# Altium schematic sheet Sheet1.SchDoc
size A
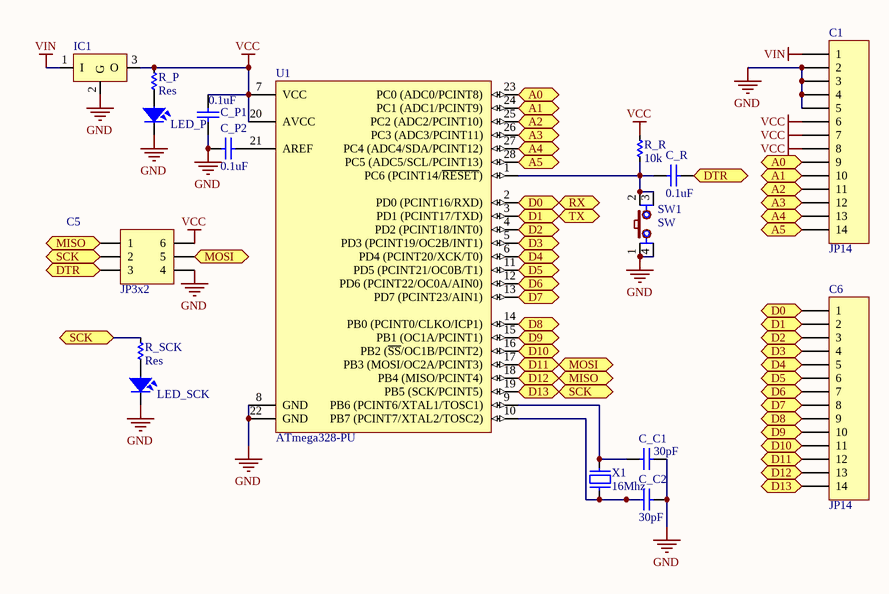
[diagram p0: Sheet1.SchDoc]

## Parts
C1  JP14  [JP14-D1T]
C5  JP3x2  [JP3-C2T]
C6  JP14  [JP14-D1T]
C_C1  value 30pF  [Cap Non-Pol 3mm]  (hidden comment: Cap Non-pol)
C_C2  value 30pF  [Cap Non-Pol 3mm]  (hidden comment: Cap Non-pol)
C_P1  value 0.1uF  [Cap Non-Pol 3mm]  (hidden comment: Cap Non-pol)
C_P2  value 0.1uF  [Cap Non-Pol 3mm]  (hidden comment: Cap Non-pol)
C_R  value 0.1uF  [Cap Non-Pol 3mm]  (hidden comment: Cap Non-pol)
IC1  LM78xx  [TO92-321]  (value not drawn)
LED_P  LED  [LED-3MM-BLUE]  (value not drawn)
LED_SCK  LED  [LED-3MM-BLUE]  (value not drawn)
R_P  Res  [RES-1/4W]
R_R  10k  [RES-1/4W]
R_SCK  Res  [RES-1/4W]
SW1  SW  [SW2-DIP]
U1  ATmega328-PU  [DIP28]
X1  16Mhz  [XT2]

## Ports
A0, A1, A2, A3, A4, A5, D0, D1, D2, D3, D4, D5, D6, D7, D8, D9, D10, D11, D12, D13, DTR, MISO, MOSI, RX, SCK, TX

## Nets
GND: C1.2 C1.3 C1.4 C1.5 C5.4 C_C1.2 C_C2.2 C_P1.1 C_P2.1 IC1.2(G) LED_P.2 LED_SCK.2 SW1.1 SW1.4 U1.8(GND) U1.22(GND)
VCC: C1.6 C1.7 C1.8 C5.6 C_P1.2 IC1.3(O) R_P.1 R_R.1 U1.7(VCC) U1.20(AVCC)
VIN: C1.1 IC1.1(I)
A0: C1.9 U1.23(PC0_(ADC0/PCINT8)) ; port A0
A1: C1.10 U1.24(PC1_(ADC1/PCINT9)) ; port A1
A2: C1.11 U1.25(PC2_(ADC2/PCINT10)) ; port A2
A3: C1.12 U1.26(PC3_(ADC3/PCINT11)) ; port A3
A4: C1.13 U1.27(PC4_(ADC4/SDA/PCINT12)) ; port A4
A5: C1.14 U1.28(PC5_(ADC5/SCL/PCINT13)) ; port A5
D0: C6.1 U1.2(PD0_(PCINT16/RXD)) ; port D0, port RX
D1: C6.2 U1.3(PD1_(PCINT17/TXD)) ; port D1, port TX
D2: C6.3 U1.4(PD2_(PCINT18/INT0)) ; port D2
D3: C6.4 U1.5(PD3_(PCINT19/OC2B/INT1)) ; port D3
D4: C6.5 U1.6(PD4_(PCINT20/XCK/T0)) ; port D4
D5: C6.6 U1.11(PD5_(PCINT21/OC0B/T1)) ; port D5
D6: C6.7 U1.12(PD6_(PCINT22/OC0A/AIN0)) ; port D6
D7: C6.8 U1.13(PD7_(PCINT23/AIN1)) ; port D7
D8: C6.9 U1.14(PB0_(PCINT0/CLKO/ICP1)) ; port D8
D9: C6.10 U1.15(PB1_(OC1A/PCINT1)) ; port D9
D10: C6.11 U1.16(PB2_(~{SS}/OC1B/PCINT2)) ; port D10
D11: C5.5 C6.12 U1.17(PB3_(MOSI/OC2A/PCINT3)) ; port D11, port MOSI
D12: C5.1 C6.13 U1.18(PB4_(MISO/PCINT4)) ; port D12, port MISO
D13: C5.2 C6.14 R_SCK.1 U1.19(PB5_(SCK/PCINT5)) ; port D13, port SCK
DTR: C5.3 C_R.2 ; port DTR
NetC_C1_1: C_C1.1 U1.9(PB6_(PCINT6/XTAL1/TOSC1)) X1.2
NetC_C2_1: C_C2.1 U1.10(PB7_(PCINT7/XTAL2/TOSC2)) X1.1
NetC_P2_2: C_P2.2 U1.21(AREF)
NetC_R_1: C_R.1 R_R.2 SW1.2 SW1.3 U1.1(PC6_(PCINT14/~{RESET}))
NetLED_P_1: LED_P.1 R_P.2
NetLED_SCK_1: LED_SCK.1 R_SCK.2

## Library data of the parts
C1 C6 = JP14: WR-PHD 2.54 mm Angled Socket Header; Manufacturer: W¨¹rth Elektronik eiSos GmbH; partNo: 613014143121; ComponentLink1 Description: Manufacturer; ComponentLink2 Description: Datasheet; NoPins: 14; Created Date: 29 March 2013; ComponentLink1URL: http://www.we-online.com; ComponentLink2URL: http://katalog.we-online.de/em/datasheet/6130xx143121.pdf; Created by: Karrer Zheng
C5 = JP3x2: WR-PHD 2.54 mm Dual Socket Header; Manufacturer: W¨¹rth Elektronik eiSos GmbH; partNo: 61300621821; ComponentLink1 Description: Manufacturer; ComponentLink2 Description: Datasheet; NoPins: 06; Created Date: 29 March 2013; ComponentLink1URL: http://www.we-online.com; ComponentLink2URL: http://katalog.we-online.de/em/datasheet/6130xx21821.pdf; Created by: Karrer Zheng
C_C1 C_C2 C_P1 C_P2 C_R = Cap Non-pol: Non-polarized Capacitor; Published: 8-Jun-2000; LatestRevisionDate: 17-Jul-2002; LatestRevisionNote: Re-released for DXP Platform.; PackageReference: RAD-0.3; Publisher: Altium Limited
IC1 = LM78xx: Positive Voltage Regulator; Note: Tab is connected to pin 3 (GND).; Published: 24-Aug-2001; LatestRevisionDate: 17-Jul-2002; LatestRevisionNote: Re-released for DXP Platform.; DatasheetVersion: Apr-1994; PackageVersion: Jul-1998; PackageReference: ISOWATT220AB; Publisher: Altium Limited; PackageDescription: TO, Thru-Hole, Vertical, Heatsink Mounted; 3 In-Line Leads; Pitch 2.54 mm; Pin sequence 1, 3, 2; ComponentLink1Description: Manufacturer Link; ComponentLink1URL: http://www.st.com/; ComponentLink2Description: Datasheet; ComponentLink2URL: http://www.st.com/stonline/products/literature/ds/2146/l78m05c.pdf
LED_P LED_SCK = LED: LED Single colour Green and Red; Value: LED 3 ly Single Colour
R_P R_R R_SCK = Res: Manufacturer: Generic Components; Class: Passive; SubClass: R; Published: 08/06/2000; Publisher: Altium Hobart Technology Centre
SW1 = SW4: Switch button 4 pin; Value: Button chip 4 pin
U1 = ATmega328-PU: 8-bit AVR Microcontroller, 32KB Flash, 1KB EEPROM, 2KB SRAM, 28-pin PDIP, Industrial Grade (-40°C to 85°C); Published: 1-Apr-2010; DatasheetVersion: revA, Jan-2010; PackageVersion: revB, Sep-2001; PackageReference: 28P3; Publisher: Altium Limited; PackageDescription: 28-lead (0.300"/7.62mm Wide) Plastic Dual Inline Package (PDIP); Supplier 1: Digi-Key; Supplier Part Number 1: ATMEGA328-PU-ND; Supplier 2: Mouser; Supplier Part Number 2: 556-ATMEGA328-PU; ComponentLink1Description: Manufacturer Link; ComponentLink1URL: http://www.atmel.com/products/avr/default.asp?; ComponentLink2Description: ATmega48A/48PA/88A/88PA/168A/168PA/328/328P Datasheet; ComponentLink2URL: http://www.atmel.com/dyn/resources/prod_documents/8271.pdf; ComponentLink3Description: ATmega48A/48PA/88A/88PA/168A/168PA/328/328P Summary; ComponentLink3URL: http://www.atmel.com/dyn/resources/prod_documents/8271S.pdf; ComponentLink4Description: Atmel.com Home; ComponentLink4URL: http://www.atmel.com
X1 = XT2: Crystal, 32.768 KHz, -40 to 85 degC, 3.2 x 1.5 x 0.9 mm SMD; Value: 16Mhz